# Altium schematic sheet 02_Power_Diagram.SchDoc
size A4; SheetNumber: 1; SheetTotal: 8
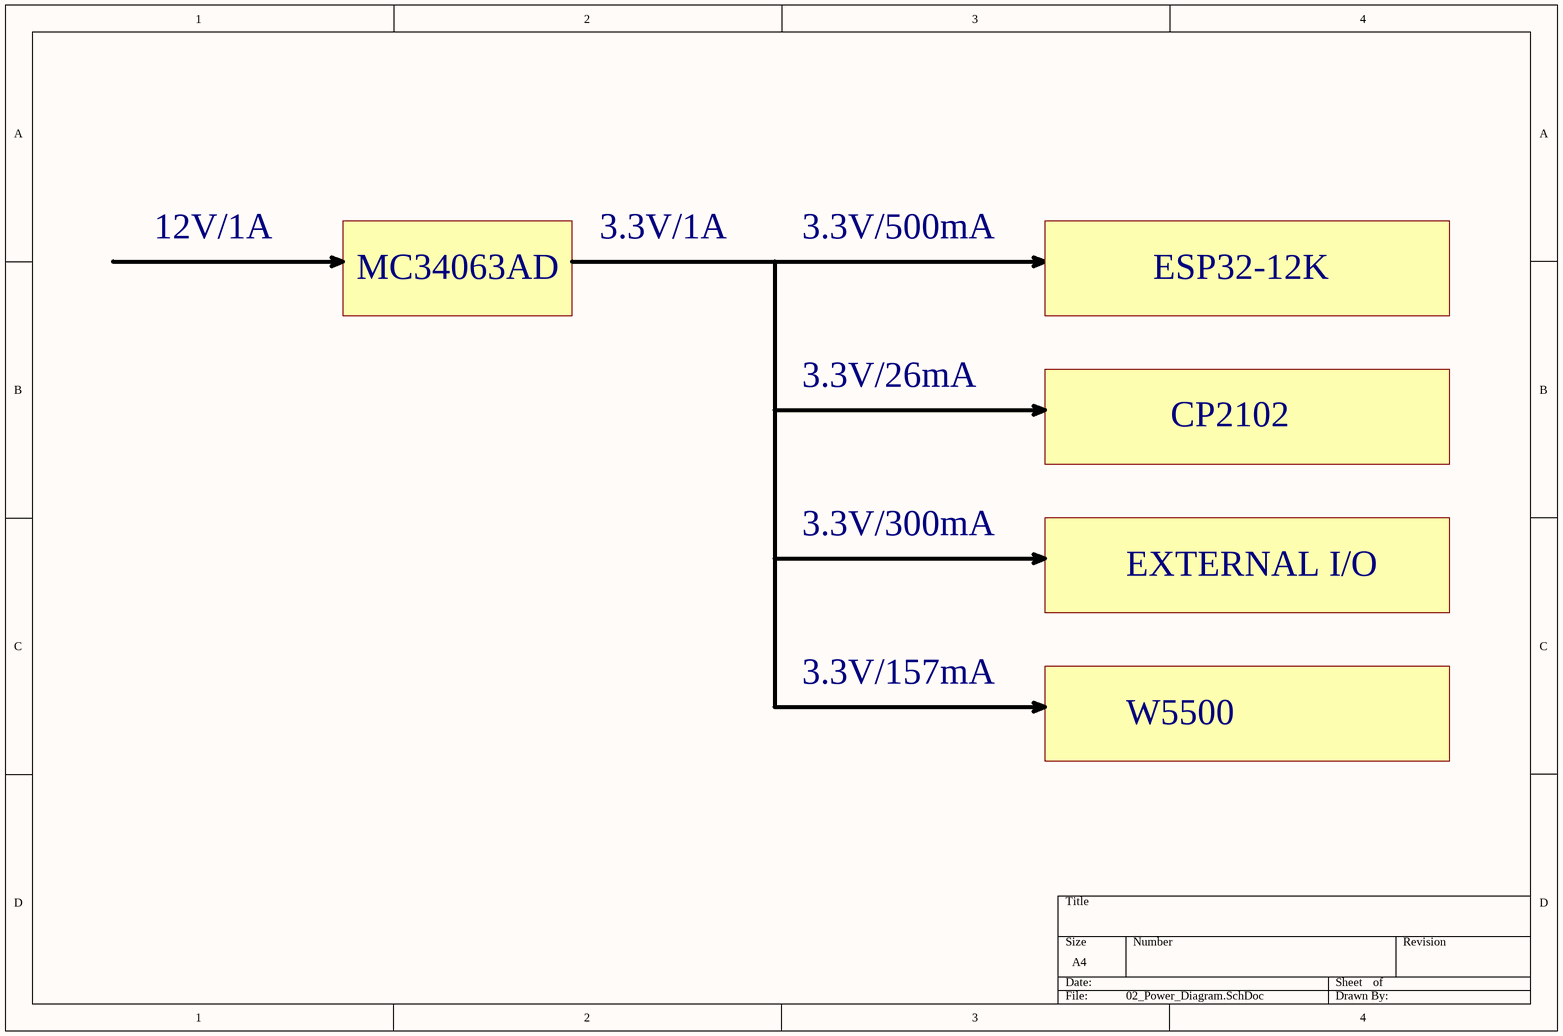
[diagram p0: 02_Power_Diagram.SchDoc]

## Notes on the sheet
- 12V/1A
- 3.3V/1A
- 3.3V/500mA
- MC34063AD
- ESP32-12K
- 3.3V/26mA
- CP2102
- 3.3V/300mA
- EXTERNAL I/O
- 3.3V/157mA
- W5500